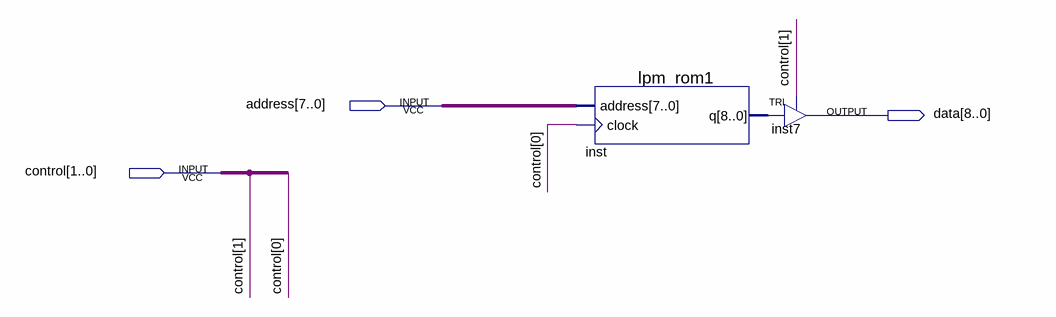
[diagram p0: schematic sheet]
// Quartus schematic ROM.bdf as structural Verilog: 2 symbols, 3 pins
module ROM (
  input  [7:0] address,
  input  [1:0] control,
  output [8:0] data
);

  wire [8:0] inst_q;

  lpm_rom1 inst (.address(address), .clock(control[0]), .q(inst_q));
  TRI inst7[8:0] (.IN(inst_q), .OE(control[1]), .OUT(data));
endmodule
